# Altium project PCB_Project.PrjPcb
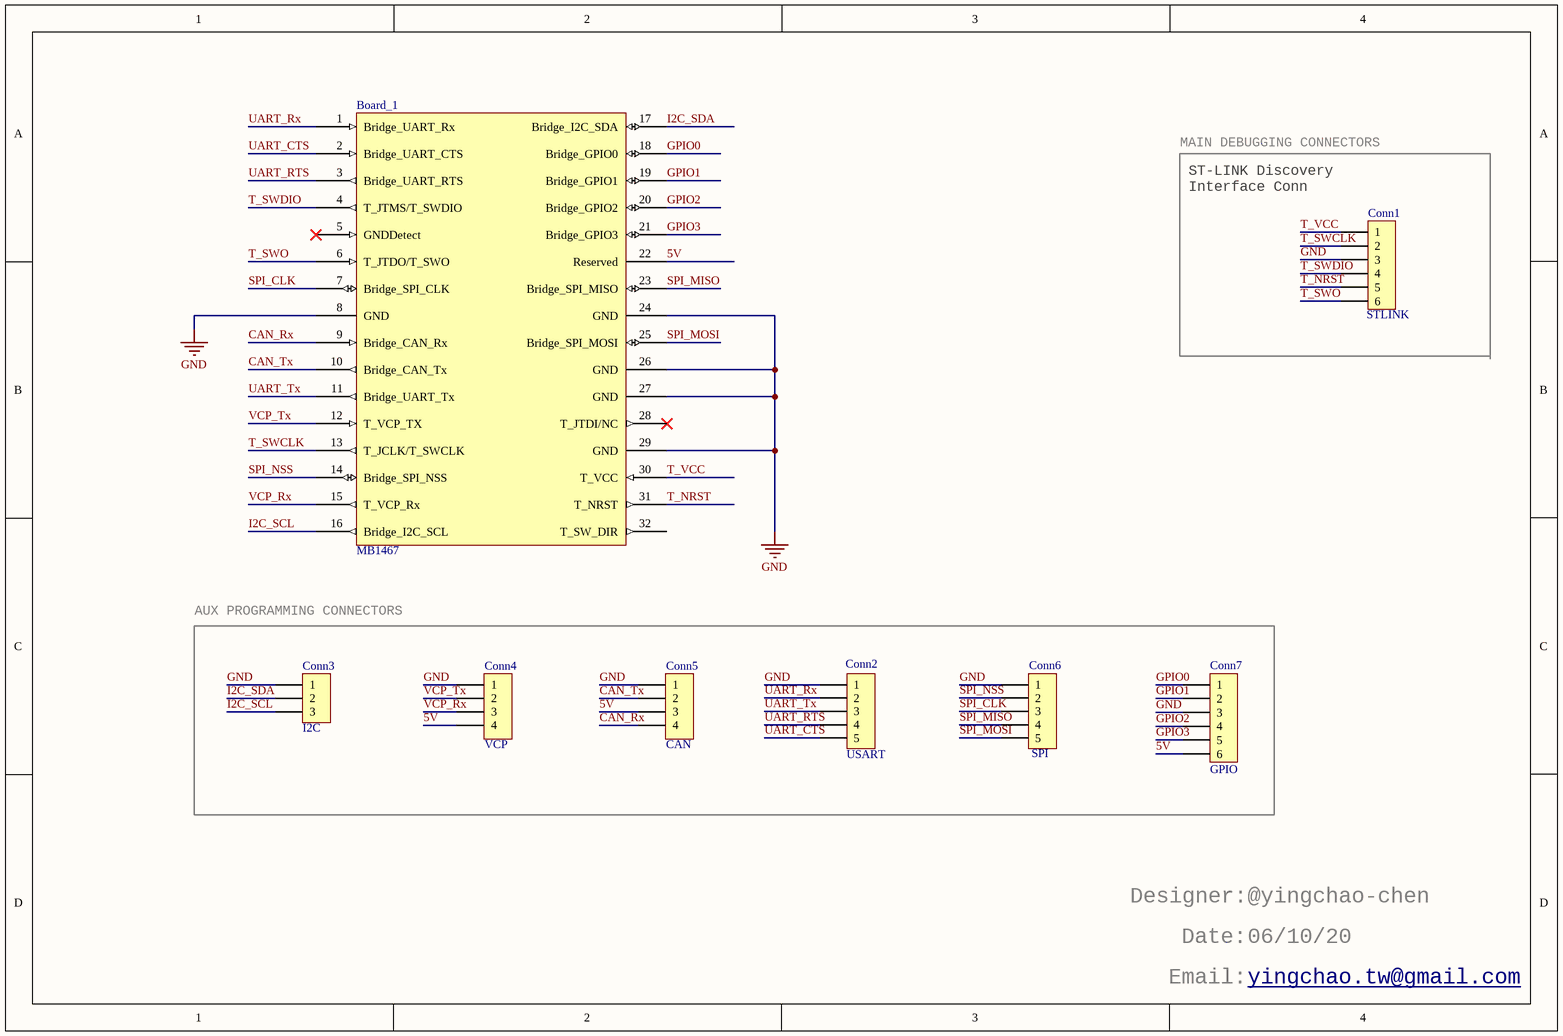
[diagram p0: STLINKV3_Adapter.SchDoc]
1 sheet, 8 parts. Net scope: global (net labels, ports and power ports of the same name join across sheets).
Board file: STLINKV3_Adapter.PcbDoc

## Sheet STLINKV3_Adapter.SchDoc
size A4

### Parts
Board_1  MB1467  [MB1467]
Conn1  STLINK  [CONNECT_6P_90]
Conn2  USART  [CONNECT_5P]
Conn3  I2C  [CONNECT_3P]
Conn4  VCP  [CONNECT_4P]
Conn5  CAN  [CONNECT_4P]
Conn6  SPI  [CONNECT_5P]
Conn7  GPIO  [CONNECT_6P]

### Blocks framed on the sheet
AUX PROGRAMMING CONNECTORS: Conn2-Conn7

### Nets
GND: Board_1.8(GND) Board_1.24(GND) Board_1.26(GND) Board_1.27(GND) Board_1.29(GND) Conn1.3 Conn2.1 Conn3.1 Conn4.1 Conn5.1 Conn6.1 Conn7.3
5V: Board_1.22(Reserved) Conn4.4 Conn5.3 Conn7.6
CAN_Rx: Board_1.9(Bridge_CAN_Rx) Conn5.4
CAN_Tx: Board_1.10(Bridge_CAN_Tx) Conn5.2
GPIO0: Board_1.18(Bridge_GPIO0) Conn7.1
GPIO1: Board_1.19(Bridge_GPIO1) Conn7.2
GPIO2: Board_1.20(Bridge_GPIO2) Conn7.4
GPIO3: Board_1.21(Bridge_GPIO3) Conn7.5
I2C_SCL: Board_1.16(Bridge_I2C_SCL) Conn3.3
I2C_SDA: Board_1.17(Bridge_I2C_SDA) Conn3.2
SPI_CLK: Board_1.7(Bridge_SPI_CLK) Conn6.3
SPI_MISO: Board_1.23(Bridge_SPI_MISO) Conn6.4
SPI_MOSI: Board_1.25(Bridge_SPI_MOSI) Conn6.5
SPI_NSS: Board_1.14(Bridge_SPI_NSS) Conn6.2
T_NRST: Board_1.31(T_NRST) Conn1.5
T_SWCLK: Board_1.13(T_JCLK/T_SWCLK) Conn1.2
T_SWDIO: Board_1.4(T_JTMS/T_SWDIO) Conn1.4
T_SWO: Board_1.6(T_JTDO/T_SWO) Conn1.6
T_VCC: Board_1.30(T_VCC) Conn1.1
UART_CTS: Board_1.2(Bridge_UART_CTS) Conn2.5
UART_RTS: Board_1.3(Bridge_UART_RTS) Conn2.4
UART_Rx: Board_1.1(Bridge_UART_Rx) Conn2.2
UART_Tx: Board_1.11(Bridge_UART_Tx) Conn2.3
VCP_Rx: Board_1.15(T_VCP_Rx) Conn4.3
VCP_Tx: Board_1.12(T_VCP_TX) Conn4.2

Not connected (* = marked no-connect by the designer): Board_1 5(GNDDetect)* 28(T_JTDI/NC)* 32(T_SW_DIR)

### Notes on the sheet
- MAIN DEBUGGING CONNECTORS
- (near Conn1) ST-LINK Discovery
  Interface Conn
- Designer:
- @yingchao-chen
- Email:
- Date:
- 06/10/20
- yingchao.tw@gmail.com <http://yingchao.tw@gmail.com>

### Library data of the parts
Conn1 Conn7 = CONN_06: Header, 6-Pin; GateName_1: G$1; DeviceName: SILK_FEMALE_PTH; PROD_ID: CONN-08437; SymbolName_1: CONN_06; LibraryName: SparkFun-Connectors; DeviceSetName: CONN_06
Conn2 Conn6 = CONN_05: Header, 5-Pin; GateName_1: G$1; SymbolName_1: CONN_05; LibraryName: SparkFun-Connectors; DeviceSetName: CONN_05
Conn3 = CONN_03: Header, 3-Pin
Conn4 Conn5 = CONN_04: Header, 4-Pin; GateName_1: G$1; PROD_ID: CONN-09696; SymbolName_1: CONN_04; LibraryName: SparkFun-Connectors; DeviceSetName: CONN_04